# Altium schematic sheet 6_Interfaces.SchDoc
size B; SheetNumber: 6; SheetTotal: 6
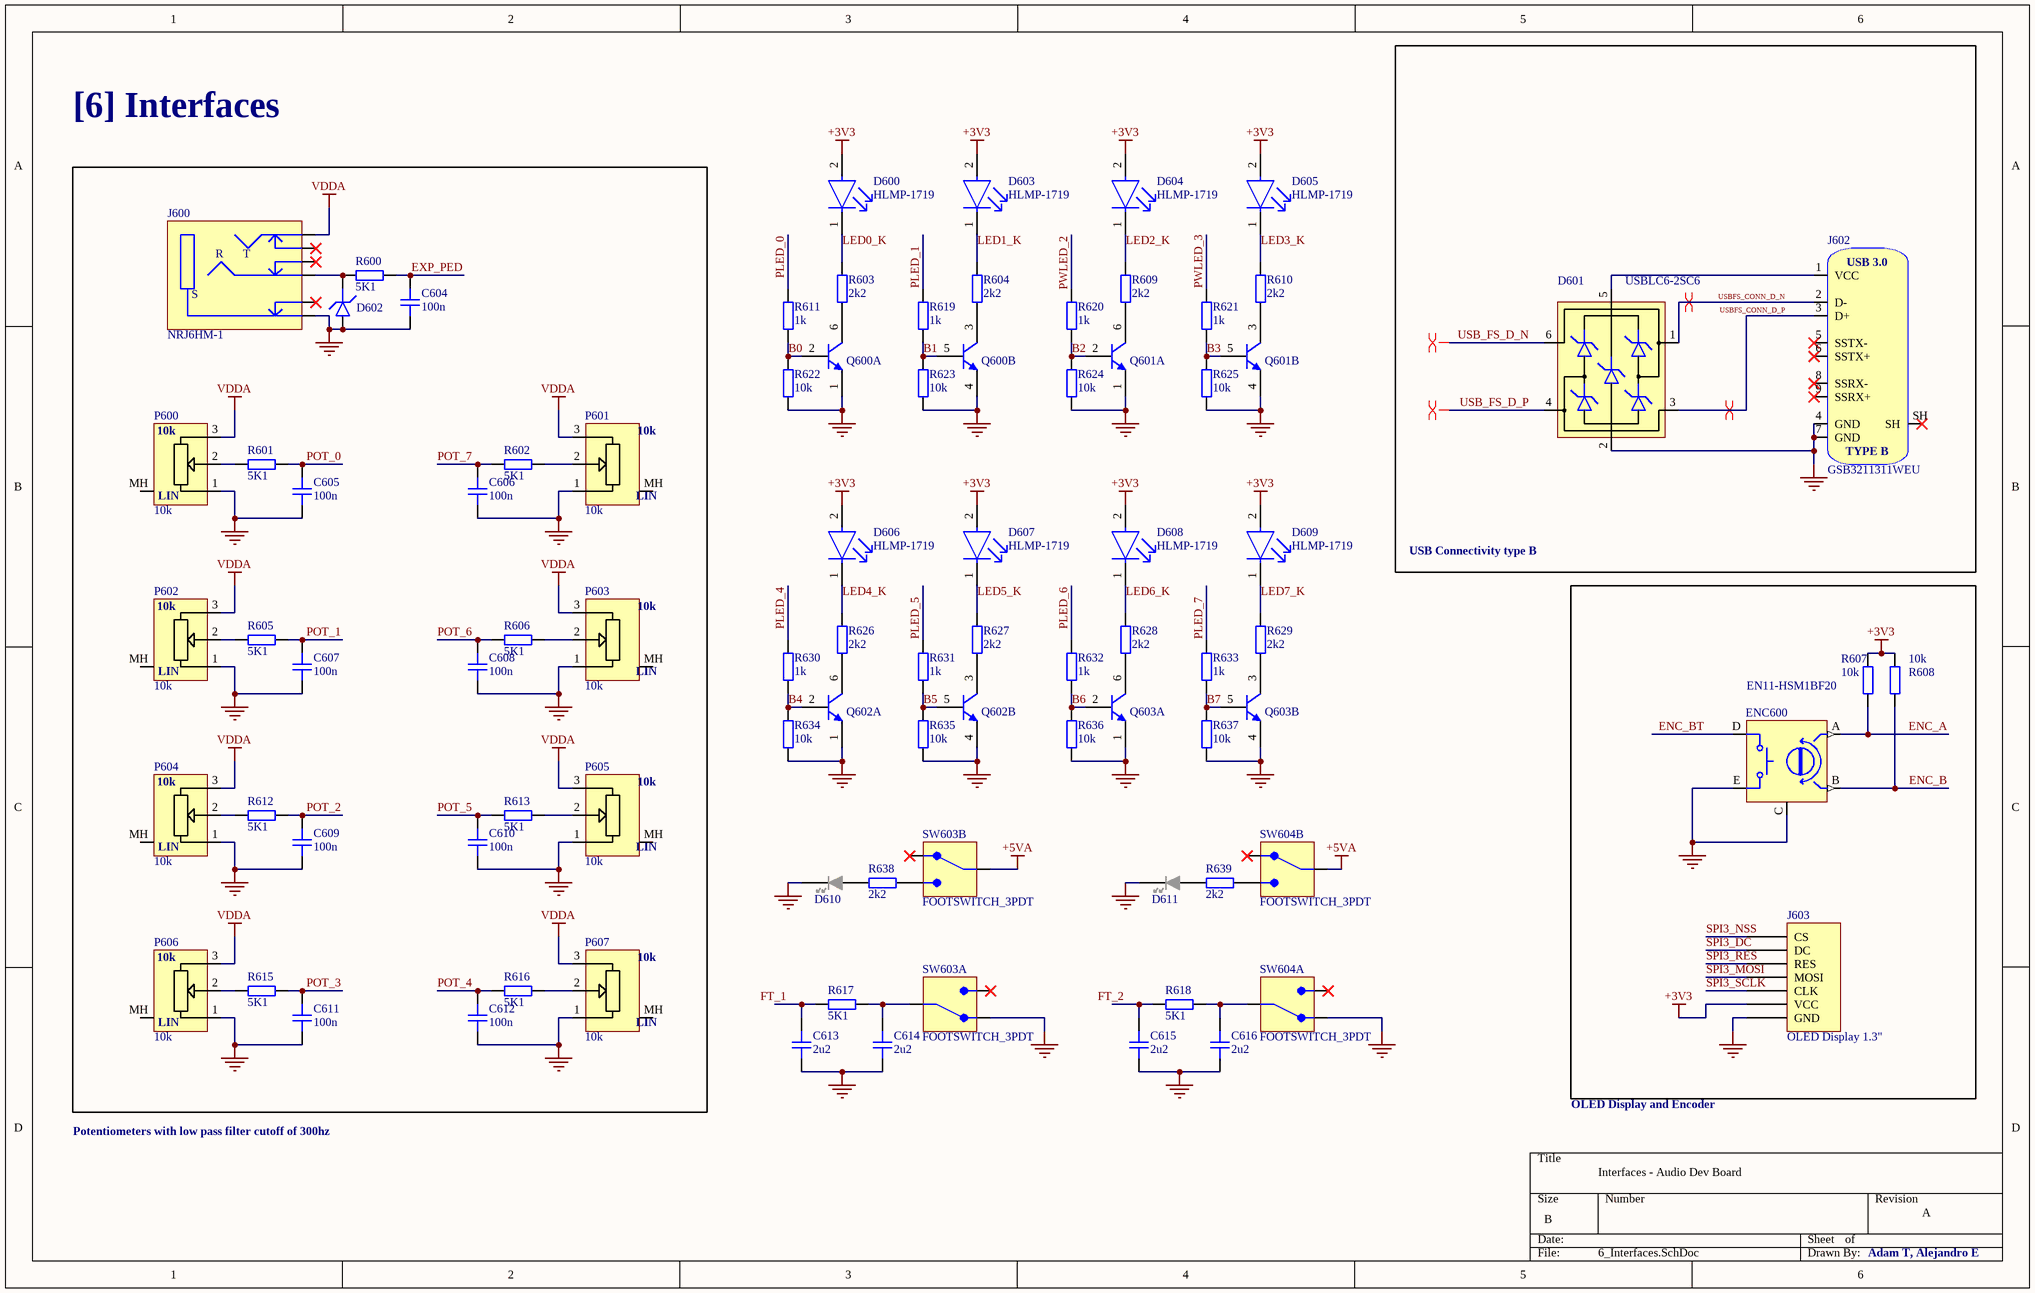
[diagram p0: 6_Interfaces.SchDoc]

## Parts
C604  100n  [CAP_0402]
C605  100n  [CAP_0402]
C606  100n  [CAP_0402]
C607  100n  [CAP_0402]
C608  100n  [CAP_0402]
C609  100n  [CAP_0402]
C610  100n  [CAP_0402]
C611  100n  [CAP_0402]
C612  100n  [CAP_0402]
C613  2u2  [CAP_0402]
C614  2u2  [CAP_0402]
C615  2u2  [CAP_0402]
C616  2u2  [CAP_0402]
D600  HLMP-1719  [FP-HLMP-1719-MFG]
D601  USBLC6-2SC6  [SOT-23-6]
D602  CG0402MLU-12G  [D_0402]  (value not drawn)
D603  HLMP-1719  [FP-HLMP-1719-MFG]
D604  HLMP-1719  [FP-HLMP-1719-MFG]
D605  HLMP-1719  [FP-HLMP-1719-MFG]
D606  HLMP-1719  [FP-HLMP-1719-MFG]
D607  HLMP-1719  [FP-HLMP-1719-MFG]
D608  HLMP-1719  [FP-HLMP-1719-MFG]
D609  HLMP-1719  [FP-HLMP-1719-MFG]
D610  LED  [SLM-530]  (value not drawn)
D611  LED  [SLM-530]  (value not drawn)
ENC600  EN11-HSM1BF20  [EN11-HSM]
J600  NRJ6HM-1  [NRJ6HM-1]
J602  GSB3211311WEU  [GSB3211311WEU]
J603  OLED Display 1.3"  [OLED Display: 128x64, 1.3",]
P600  10k  [P0915N-EC15BR10K]
P601  10k  [P0915N-EC15BR10K]
P602  10k  [P0915N-EC15BR10K]
P603  10k  [P0915N-EC15BR10K]
P604  10k  [P0915N-EC15BR10K]
P605  10k  [P0915N-EC15BR10K]
P606  10k  [P0915N-EC15BR10K]
P607  10k  [P0915N-EC15BR10K]
Q600  MBT3904DW1T1G  [ONSC-SOT-363-6-419B-02_W_V]  (value not drawn)  (parts A,B of 2)
Q601  MBT3904DW1T1G  [ONSC-SOT-363-6-419B-02_W_V]  (value not drawn)  (parts A,B of 2)
Q602  MBT3904DW1T1G  [ONSC-SOT-363-6-419B-02_W_V]  (value not drawn)  (parts A,B of 2)
Q603  MBT3904DW1T1G  [ONSC-SOT-363-6-419B-02_W_V]  (value not drawn)  (parts A,B of 2)
R600  5K1  [RES_0402]
R601  5K1  [RES_0402]
R602  5K1  [RES_0402]
R603  2k2  [RES_0402]
R604  2k2  [RES_0402]
R605  5K1  [RES_0402]
R606  5K1  [RES_0402]
R607  10k  [RES_0402]
R608  10k  [RES_0402]
R609  2k2  [RES_0402]
R610  2k2  [RES_0402]
R611  1k  [RES_0402]
R612  5K1  [RES_0402]
R613  5K1  [RES_0402]
R615  5K1  [RES_0402]
R616  5K1  [RES_0402]
R617  5K1  [RES_0402]
R618  5K1  [RES_0402]
R619  1k  [RES_0402]
R620  1k  [RES_0402]
R621  1k  [RES_0402]
R622  10k  [RES_0402]
R623  10k  [RES_0402]
R624  10k  [RES_0402]
R625  10k  [RES_0402]
R626  2k2  [RES_0402]
R627  2k2  [RES_0402]
R628  2k2  [RES_0402]
R629  2k2  [RES_0402]
R630  1k  [RES_0402]
R631  1k  [RES_0402]
R632  1k  [RES_0402]
R633  1k  [RES_0402]
R634  10k  [RES_0402]
R635  10k  [RES_0402]
R636  10k  [RES_0402]
R637  10k  [RES_0402]
R638  2k2  [RES_0402]
R639  2k2  [RES_0402]
SW603  FOOTSWITCH_3PDT  [FOOTSWITCH_3PDT]  (parts A,B of 3)
SW604  FOOTSWITCH_3PDT  [FOOTSWITCH_3PDT]  (parts A,B of 3)

## Blocks framed on the sheet
USB Connectivity type B: D601 J602

## Nets
+3V3: D600.2(A) D603.2(A) D604.2(A) D605.2(A) D606.2(A) D607.2(A) D608.2(A) D609.2(A) J603.VCC R607.2 R608.2
+5VA: SW603.COM2 SW604.COM2
GND: C604.1 C605.1 C606.1 C607.1 C608.1 C609.1 C610.1 C611.1 C612.1 C613.1 C614.1 C615.1 C616.1 D601.2(GND) D602.A D610.K D611.K ENC600.C(GND) ENC600.E J600.S J602.4(GND) J602.7(GND) J603.Gnd(GND) P600.1 P601.1 P602.1 P603.1 P604.1 P605.1 P606.1 P607.1 Q600.1(E) Q600.4(E) Q601.1(E) Q601.4(E) Q602.1(E) Q602.4(E) Q603.1(E) Q603.4(E) R622.1 R623.1 R624.1 R625.1 R634.1 R635.1 R636.1 R637.1 SW603.NC1 SW604.NC1
VDDA: J600.T P600.3 P601.3 P602.3 P603.3 P604.3 P605.3 P606.3 P607.3
B0: Q600.2(B) R611.1 R622.2
B1: Q600.5(B) R619.1 R623.2
B2: Q601.2(B) R620.1 R624.2
B3: Q601.5(B) R621.1 R625.2
B4: Q602.2(B) R630.1 R634.2
B5: Q602.5(B) R631.1 R635.2
B6: Q603.2(B) R632.1 R636.2
B7: Q603.5(B) R633.1 R637.2
ENC_A: ENC600.A R607.1
ENC_B: ENC600.B R608.1
ENC_BT: ENC600.D
EXP_PED: C604.2 R600.2
FT_1: C613.2 R617.1
FT_2: C615.2 R618.1
LED0_K: D600.1(C) R603.2
LED1_K: D603.1(C) R604.2
LED2_K: D604.1(C) R609.2
LED3_K: D605.1(C) R610.2
LED4_K: D606.1(C) R626.2
LED5_K: D607.1(C) R627.2
LED6_K: D608.1(C) R628.2
LED7_K: D609.1(C) R629.2
PLED_0: R611.2
PLED_1: R619.2
PLED_4: R630.2
PLED_5: R631.2
PLED_6: R632.2
PLED_7: R633.2
POT_0: C605.2 R601.2
POT_1: C607.2 R605.2
POT_2: C609.2 R612.2
POT_3: C611.2 R615.2
POT_4: C612.2 R616.1
POT_5: C610.2 R613.1
POT_6: C608.2 R606.1
POT_7: C606.2 R602.1
PWLED_2: R620.2
PWLED_3: R621.2
SPI3_DC: J603.DC
SPI3_MOSI: J603.MOSI
SPI3_NSS: J603.CS
SPI3_RES: J603.RES
SPI3_SCLK: J603.CLK
USB_FS_D_N: D601.6(IO1)
USB_FS_D_P: D601.4(IO2)
USBFS_CONN_D_N: D601.1(IO1) J602.2(D-)
USBFS_CONN_D_P: D601.3(IO2) J602.3(D+)
NetC614_2: C614.2 R617.2 SW603.COM1
NetC616_2: C616.2 R618.2 SW604.COM1
NetD601_5: D601.5(VBUS) J602.1(VCC)
NetD602_K: D602.K J600.R R600.1
NetD610_A: D610.A R638.2
NetD611_A: D611.A R639.2
NetP600_2: P600.2 R601.1
NetP601_2: P601.2 R602.2
NetP602_2: P602.2 R605.1
NetP603_2: P603.2 R606.2
NetP604_2: P604.2 R612.1
NetP605_2: P605.2 R613.2
NetP606_2: P606.2 R615.1
NetP607_2: P607.2 R616.2
NetQ600_3: Q600.3(C) R604.1
NetQ600_6: Q600.6(C) R603.1
NetQ601_3: Q601.3(C) R610.1
NetQ601_6: Q601.6(C) R609.1
NetQ602_3: Q602.3(C) R627.1
NetQ602_6: Q602.6(C) R626.1
NetQ603_3: Q603.3(C) R629.1
NetQ603_6: Q603.6(C) R628.1
NetR638_1: R638.1 SW603.NO2
NetR639_1: R639.1 SW604.NO2

Not connected (* = marked no-connect by the designer): J600 RN* SN* TN*; J602 5(SSTX-)* 6(SSTX+)* 8(SSRX-)* 9(SSRX+)* SH*; P600 MH; P601 MH; P602 MH; P603 MH; P604 MH; P605 MH; P606 MH; P607 MH; SW603 NC2* NO1*; SW604 NC2* NO1*

## Layout directives
differential pair; differential pair class DIFF_USB: USB_FS_D_N, USB_FS_D_P, USBFS_CONN_D_N, USBFS_CONN_D_P

## Notes on the sheet
- [6] Interfaces
- OLED Display and Encoder
- Potentiometers with low pass filter cutoff of 300hz
- Interfaces - Audio Dev Board
- A
- Adam T, Alejandro E
- (in symbol GSB3211311WEU) USB 3.0; TYPE B
- (in symbol P0915N-EC15BR10K) LIN

## Library data of the parts
C604-C616 = CAP_0402: Capacitor SMD 0402; Manufacturer: *; Manufacturer Part Number: *; Distributor Link: *; LCSC: *; Rating: *; Dielectric: *
D600 D603-D609 = CMP-2000-06410-2: LED YELLOW DIFFUSED T-1 T/H; Manufacturer: Broadcom; Wavelength: 585nm; Led Orientation: Straight; Luminous Intensity: 2.1mcd; Forward Voltage: 1.8V; Viewing Angle: 50°; Reverse Voltage: 5V; Power Dissipation: 17.5mW; Forward Current: 2mA; Lead Free: Yes; Automotive: No; Device Class L1: Optoelectronics; Mouser Description: Standard LEDs - Through Hole Yellow Diffused 585nm 2.1mcd; Digikey Description: LED YELLOW DIFFUSED T-1 T/H; Temperature: -40°C to +100°C; Temperature Range High: +100°C; Package: 0; Category: Diode; Colour: Yellow; Device Class L2: LEDs; ComponentLink2Description: Datasheet; ComponentLink2URL: https://docs.broadcom.com/docs/AV02-1557EN; Temperature Range Low: -40°C; Device Class L3: unset; Octopart: https://octopart.com/hlmp-1719-broadcom-71130405; RoHS: TRUE; Manufacturer Part Number: HLMP-1719
D601 = USBLC6-2SC6: Low-Capacitance ESD Protection USB; Manufacturer: STMicroelectronics; Manufacturer Part Number: USBLC6-2SC6; Distributor Link: https://www.mouser.de/ProductDetail/STMicroelectronics/USBLC6-2SC6?qs=po45yt2pPpu%2FhNIlwQdTlg%3D%3D
D602 = D_TVS_0402: Diode TVS / ESD 0402
D610 D611 = LED_5MM_HOLDER_17MM1: 5mm LED Holder Height 17.1mm (w/o LED); Manufacturer: BIVAR; Manufacturer Part Number: SLM-530
ENC600 = EN11-HSM1BF20: Rotary Encoder with Switch 20 Detents 7mm Bushing 20mm Threaded Shaft Vertical; Manufacturer: TT Electronics; Manufacturer Part Number: EN11-HSM1BF20; Distributor Link: https://www.mouser.de/ProductDetail/BI-Technologies-TT-Electronics/EN11-HSM1BF20?qs=%252BUYXD5bnyXp4Uf1MU7v3zw%3D%3D
J600 = NRJ6HM-1: 1/4" Stereo Jack, TRS Switched; Manufacturer: Neutrik; Manufacturer Part Number: NRJ6HM-1
J602 = GSB3211311WEU: USB Connector Type B 3.0 Through-Hole; Manufacturer: Amphenol; Manufacturer Part Number: GSB3211311WEU
J603 = OLED Display: 128x64, 1.3",: Poulolu OLED Display: 128x64, 1.3",
P600-P607 = P0915N-EC15BR10K: Potentiometer Vertical 10k Linear Taper THT PCB-Mount Smooth Shaft w/ Slot D=6mm L=15mm; Manufacturer: TT Electronics; Manufacturer Part Number: P0915N-EC15BR10K
Q600-Q603 = CMP-1048-00877-1: Dual General Purpose Transistors, 6-Pin SOT-363, Pb-Free, Tape and Reel; Manufacturer: On Semiconductor; Polarity: Dual NPN; fT Min (MHz): 300; IC Continuous (A): 0.2; DatasheetVersion: Rev. 9; ComponentLink2Description: Datasheet; Mounting Technology: Surface Mount; PackageReference: SOT-363-6-419B-02_W; RoHS: TRUE; ComponentLink1Description: Manufacturer URL; ComponentLink2URL: http://www.onsemi.com/pub_link/Collateral/MBT3904DW1T1-D.PDF; PackageVersion: Rev. W, 01/2006; Packing: Tape and Reel; PartNumber: MBT3904DW1T1G; ComponentLink1URL: http://www.onsemi.com/; ComponentLink3URL: http://www.onsemi.com/pub_link/Collateral/NTJD4001N-D.PDF; ComponentLink3Description: Package Specification; PackageDescription: 6-Pin Small Outline Transistor, Body 2 x 1.25 mm, Pitch 0.65 mm
R600-R613 R615-R639 = RES_0402: Resistor SMD 0402
  R600-R602 R605-R608 R612 R613 R615-R618: Manufacturer: *; Manufacturer Part Number: *; Distributor Link: *; LCSC: *
SW603 SW604 = FOOTSWITCH_3PDT: Generic 3PDT Footswitch; Manufacturer: *; Manufacturer Part Number: *; Link: https://lovemyswitches.com/3pdt-latched-foot-switch-solder-lugs-black/